# EAGLE schematic controlador_temperatura (EAGLE 9.6.2)
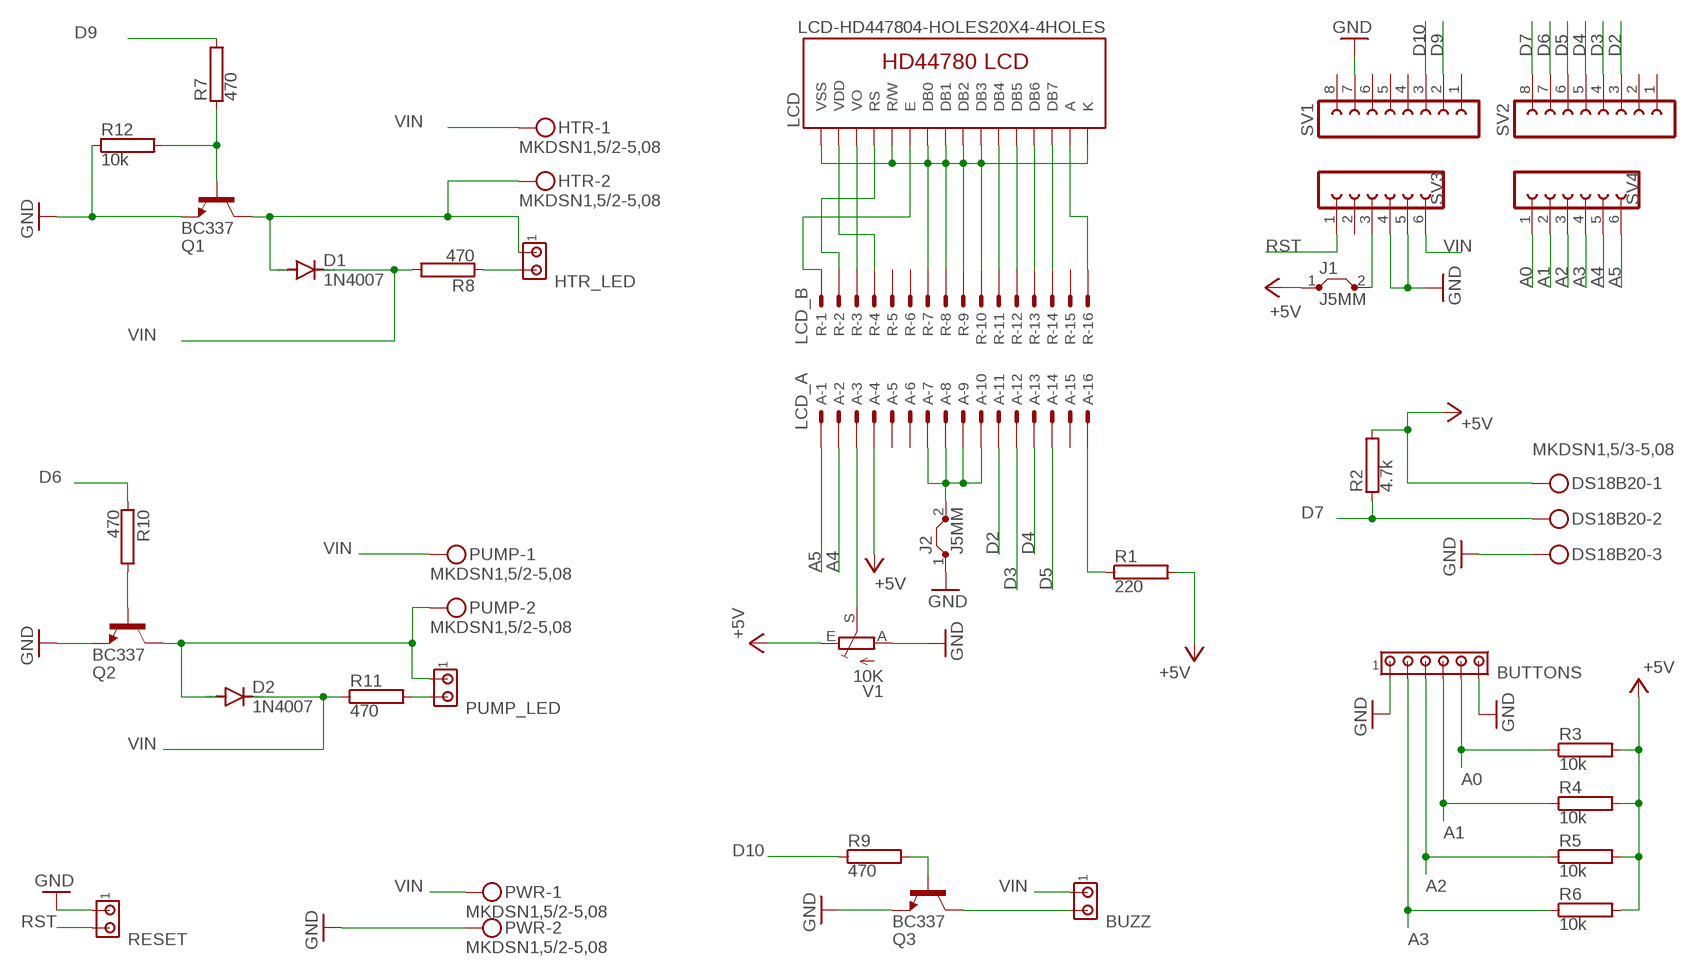
[diagram p0: schematic, sheet 1]

## Parts
A  LCD_A  057-016-1  [057-016-1]
BUTTONS  MTA06-100  [10X06MTA]
BUZZ  MTA02-100  [10X02MTA]
D1  1N4007  1N4004  [DO41-10]
D2  1N4007  1N4004  [DO41-10]
DS18B20  MKDSN1,5/3-5,08  [MKDSN1,5/3-5,08]
HTR  MKDSN1,5/2-5,08  [MKDSN1,5/2-5,08]
HTR_LED  MTA02-100  [10X02MTA]
J1  J5MM  [05]
J2  J5MM  [05]
LCD  LCD-HD447804-HOLES20X4-4HOLES  [LCD-20X4-4HOLES]
PUMP  MKDSN1,5/2-5,08  [MKDSN1,5/2-5,08]
PUMP_LED  MTA02-100  [10X02MTA]
PWR  MKDSN1,5/2-5,08  [MKDSN1,5/2-5,08]
Q1  BC337  [TO92]
Q2  BC337  [TO92]
Q3  BC337  [TO92]
R  LCD_B  057-016-1  [057-016-1]
R1  220  RRS1/8  [RS1/8]
R2  4.7k  RRS1/8  [RS1/8]
R3  10k  RRS1/8  [RS1/8]
R4  10k  RRS1/8  [RS1/8]
R5  10k  RRS1/8  [RS1/8]
R6  10k  RRS1/8  [RS1/8]
R7  470  RRS1/8  [RS1/8]
R8  470  RRS1/8  [RS1/8]
R9  470  RRS1/8  [RS1/8]
R10  470  RRS1/8  [RS1/8]
R11  470  RRS1/8  [RS1/8]
R12  10k  RRS1/8  [RS1/8]
RESET  MTA02-100  [10X02MTA]
SV1  FE08-1  [FE08]
SV2  FE08-1  [FE08]
SV3  FE06-1  [FE06]
SV4  FE06-1  [FE06]
V1  10K  TRIM_EU-B25P  [B25P]

## Nets
+5V: A.4 DS18B20.1 J1.1 J1.2 R1.2 R2.2 R3.2 R4.2 R5.2 R6.2 SV3.3 V1.E
A0: BUTTONS.5 R3.1 SV4.1
A1: BUTTONS.4 R4.1 SV4.2
A2: BUTTONS.3 R5.1 SV4.3
A3: BUTTONS.2 R6.1 SV4.4
A4: A.2 SV4.5
A5: A.1 SV4.6
D2: A.11 SV2.3
D3: A.12 SV2.4
D4: A.13 SV2.5
D5: A.14 SV2.6
D6: R10.1 SV2.7
D7: DS18B20.2 R2.1 SV2.8
D9: R7.2 SV1.2
D10: R9.1 SV1.3
GND: A.7 A.8 A.9 A.10 BUTTONS.1 BUTTONS.6 DS18B20.3 J2.1 J2.2 PWR.2 Q1.1(E) Q2.1(E) Q3.1(E) R12.1 RESET.1 SV1.7 SV3.4 SV3.5 V1.A
HTR: D1.A HTR.2 HTR_LED.1 Q1.3(C)
N$1: Q1.2(B) R7.1 R12.2
N$3: Q3.2(B) R9.2
N$4: HTR_LED.2 R8.1
N$5: Q2.2(B) R10.2
N$7: A.3 V1.S
N$8: PUMP_LED.2 R11.2
N$9: BUZZ.2 Q3.3(C)
N$10: A.16 R1.1
N$11: LCD.P$6(E) R.1
N$12: LCD.P$1(VSS) LCD.P$5(R/W) LCD.P$7(DB0) LCD.P$8(DB1) LCD.P$9(DB2) LCD.P$10(DB3) LCD.P$16(K) R.7 R.8 R.9 R.10
N$13: LCD.P$3(VO) R.3
N$14: LCD.P$15(A) R.16
N$15: LCD.P$2(VDD) R.4
N$16: LCD.P$4(RS) R.2
N$20: LCD.P$11(DB4) R.11
N$21: LCD.P$12(DB5) R.12
N$22: LCD.P$13(DB6) R.13
N$23: LCD.P$14(DB7) R.14
PUMP: D2.A PUMP.2 PUMP_LED.1 Q2.3(C)
RST: RESET.2 SV3.1
VIN: BUZZ.1 D1.C D2.C HTR.1 PUMP.1 PWR.1 R8.2 R11.1 SV3.6
Unconnected: A.5 A.6 A.15 R.5 R.6 R.15 SV1.1 SV1.4 SV1.5 SV1.6 SV1.8 SV2.1 SV2.2 SV3.2

## Library data of the parts
A R = con-panduit:057-016-: CONNECTOR 10-pin series 057 contact pc board low profile headers; OC_FARNELL: unknown; OC_NEWARK: unknown
BUTTONS = con-amp:MTA06-100: AMP connector Connection corrected 2014-09-19
BUZZ HTR_LED PUMP_LED RESET = con-amp:MTA02-100: AMP connector
D1 D2 = diode:1N4004: DIODE general purpose rectifier, 1 A
DS18B20 = con-phoenix-508:MKDSN1,5/3-5,08: MKDSN 1,5/ 3-5,08 Printklemme Nennstrom: 13,5 A Nennspannung: 250 V Rastermaß: 5,08 mm Polzahl: 3 Anschlussart: Schraubanschluss Montage: Löten Anschlussrichtung Leiter/Platine: 0 ° Artikelnummer: 1729131 Source: http://eshop.phoenixcontact.com .. 1729131.pdf
HTR PUMP PWR = con-phoenix-508:MKDSN1,5/2-5,08: MKDSN 1,5/ 2-5,08 Printklemme Nennstrom: 13,5 A Nennspannung: 250 V Rastermaß: 5,08 mm Polzahl: 2 Anschlussart: Schraubanschluss Montage: Löten Anschlussrichtung Leiter/Platine: 0 ° Artikelnummer: 1729128 Source: http://eshop.phoenixcontact.com .. 1729128.pdf
J1 J2 = jumper:J: Bridge
LCD = HD44780LCD:LCD-HD44780
Q1-Q3 = transistor-npn:BC337*: NPN Transistor
R1-R12 = resistor-power:R: Power Resitor; OC_FARNELL: unknown; OC_NEWARK: unknown
SV1 SV2 = con-lsta:FE08-1: FEMALE HEADER; OC_FARNELL: unknown; OC_NEWARK: unknown
SV3 SV4 = con-lsta:FE06-1: FEMALE HEADER; OC_FARNELL: unknown; OC_NEWARK: unknown
V1 = pot:TRIM_EU-: POTENTIOMETER